# EAGLE design SMINIPROG (EAGLE 9.6.1)
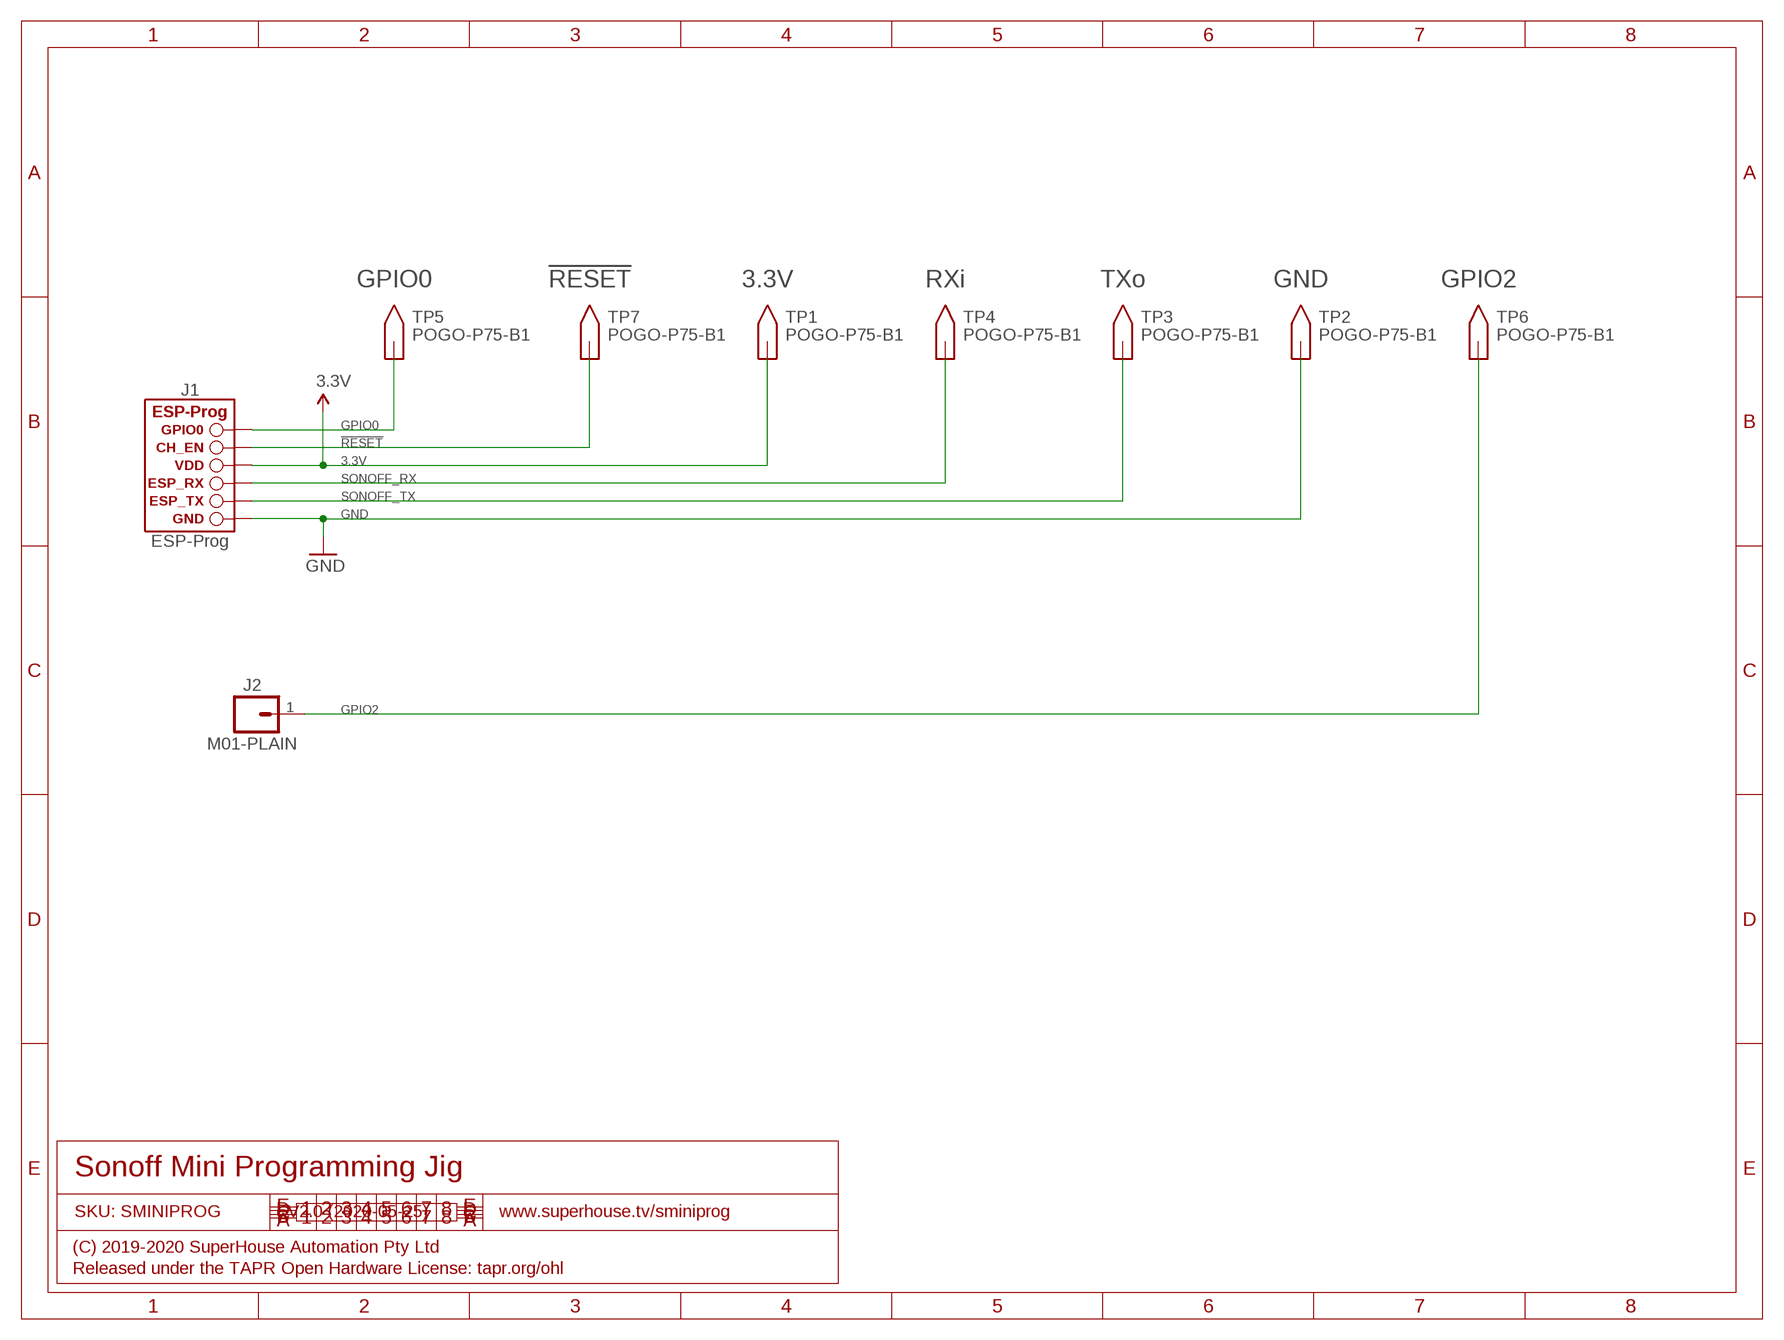
[diagram p0: schematic, sheet 1]

## Parts
J1  ESP-PROG-1X6-2.54-SOCKET-RA  [1X6-2.54-SOCKET-RA]
J2  M01-PLAIN  [1X01]
TP1  POGO-P75-B1  [PIN-1.02]
TP2  POGO-P75-B1  [PIN-1.02]
TP3  POGO-P75-B1  [PIN-1.02]
TP4  POGO-P75-B1  [PIN-1.02]
TP5  POGO-P75-B1  [PIN-1.02]
TP6  POGO-P75-B1  [PIN-1.02]
TP7  POGO-P75-B1  [PIN-1.02]

## Nets
3.3V: J1.4(VDD) TP1.P$1
!RESET: J1.5(CH_EN) TP7.P$1
GND: J1.1(GND) TP2.P$1
GPIO0: J1.6(GPIO0) TP5.P$1
GPIO2: J2.1 TP6.P$1
SONOFF_RX: J1.3(ESP_RX) TP4.P$1
SONOFF_TX: J1.2(ESP_TX) TP3.P$1

## Notes on the sheet
- GPIO0 | !RESET | 3.3V | RXi | TXo | GND | GPIO2
- Sonoff Mini Programming Jig
- SKU: SMINIPROG | V2.0 (2020-05-25) | www.superhouse.tv/sminiprog
- (C) 2019-2020 SuperHouse Automation Pty Ltd
- Released under the TAPR Open Hardware License: tapr.org/ohl

## Library data of the parts
J1 = SuperHouse-ESP-Prog:ESP-PROG: ESP-Prog ESP-Prog programming header for ESP8266, ESP8285, and ESP32. Options for both 1x6 and 2x3 formats, in 2.54mm (0.1") and 1.27mm (0.05") pitch.
J2 = SuperHouse-Connectors:M01: 1-way header Standard 1x1 header
TP1-TP7 = SuperHouse-Test:POGO

## Board
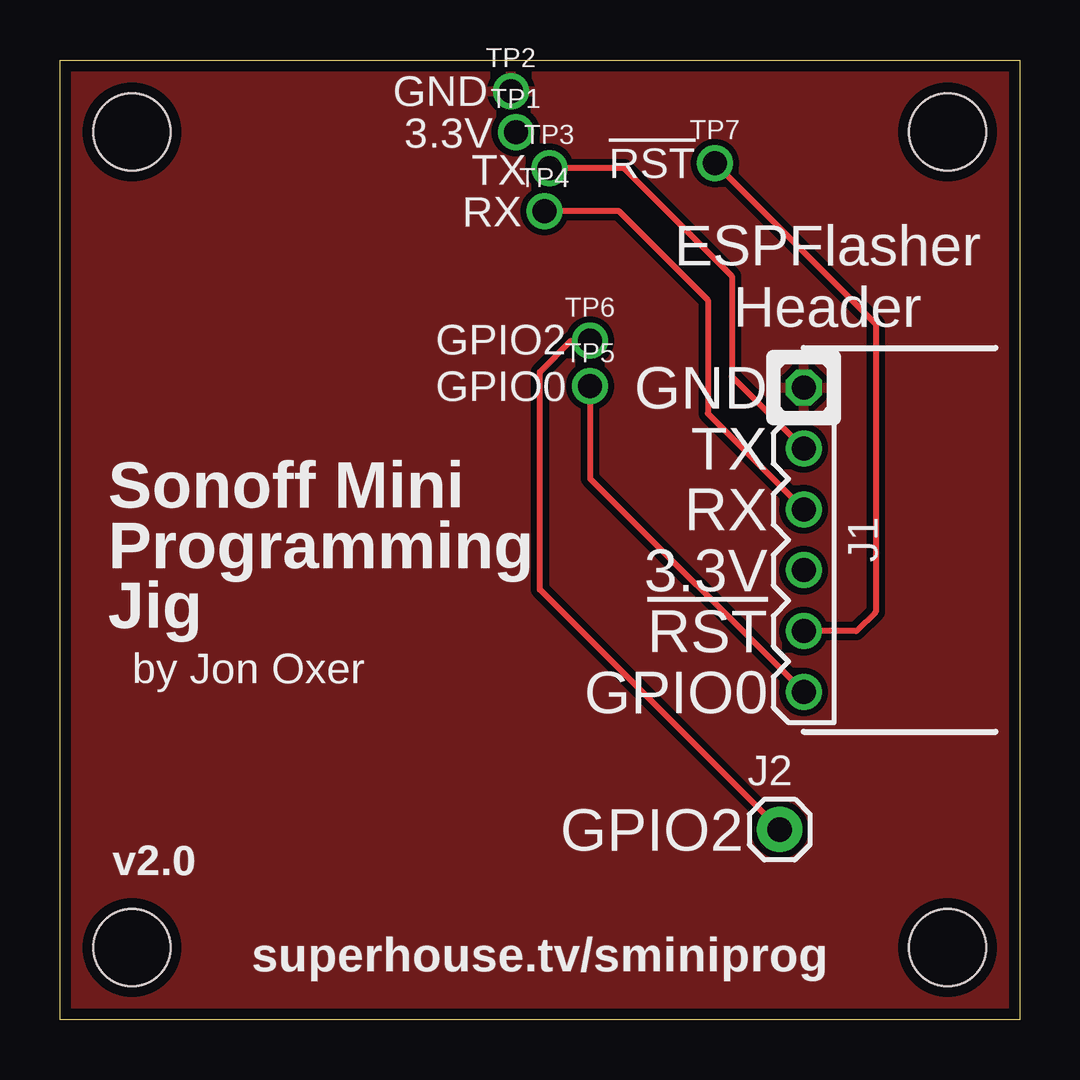
[diagram p1: board, top side]
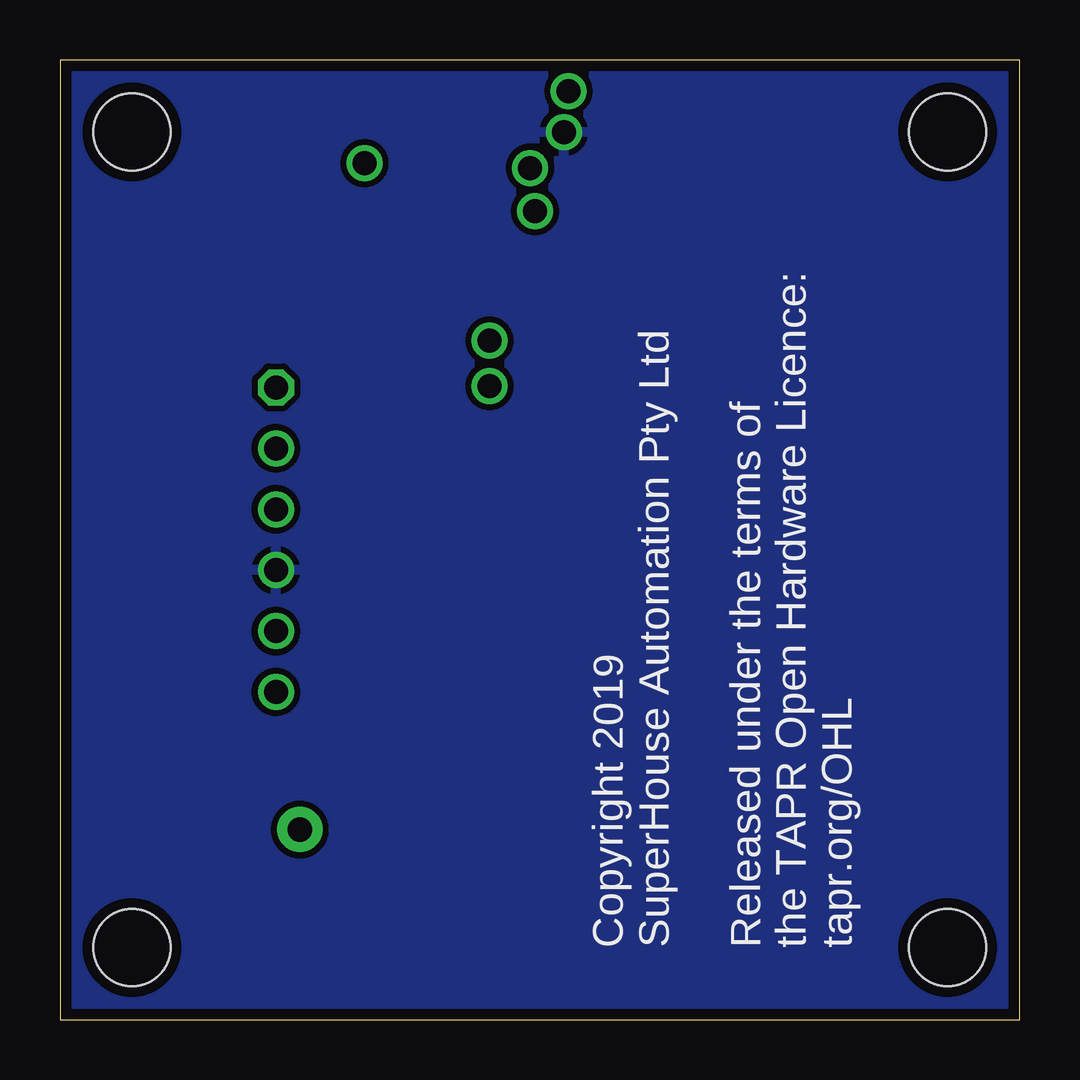
[diagram p2: board, bottom side, seen from below]

Size 40 x 40 mm. Coordinates in mm from the lower left corner, seen from the top.
Outline: 0,40 40,40 40,0 0,0 0,40
Copper layers (1*16): Top 0.035mm / dielectric 1.5mm / Bottom 0.035mm
Design rules "SuperHouse-Design-Rules": minimum track width 10mil, minimum drill 24mil, track to track 8mil, track to pad 8mil, pad to pad 8mil, via to via 8mil, smd to smd 6mil, copper to edge 18mil, drill to drill 8mil, minimum pad ring 7mil, minimum via ring 8mil, stop-mask expansion 4mil, vias tented up to drill 0.5mm, thermal gap 10mil
Holes 3.2 mm at 3,37 3,3 37,3 37,37

### Footprints (pad centres in the part's own frame; a part is rotated, then mirrored left to right if it is on the bottom)
1X6-2.54-SOCKET-RA = drill 1 octagon: 1 -6.35,0 | drill 1: 2 -3.81,0; 3 -1.27,0; 4 1.27,0; 5 3.81,0; 6 6.35,0
1X01 = drill 1.016 pad 1.88: 1 0,0
PIN-1.02 = drill 1: P$1 0,0

### Placement (x,y rotation side)
J1  31,20 270 top
J2  30,7.92 0 top
TP1  19,37 0 top
TP2  18.8,38.7 0 top
TP3  20.4,35.5 0 top
TP4  20.2,33.7 0 top
TP5  22.1,26.4 0 top
TP6  22.1,28.3 0 top
TP7  27.3,35.7 0 top

### Tracks (layer width: path | path; a pad name or v marks a point on that pad's centre or on a via)
3.3V
  pour Bottom (isolate 0.254): 40,40 40,0 0,0 0,40
!RESET
  Top 0.254: J1.5 33.19,16.19 34,17 34,29 TP7.P$1
GND
  pour Top (isolate 0.254): 40,40 40,0 0,0 0,40
GPIO0
  Top 0.254: J1.6 22.1,22.55 TP5.P$1
GPIO2
  Top 0.254: J2.1 20,17.92 20,27 21.3,28.3 TP6.P$1
SONOFF_RX
  Top 0.254: TP4.P$1 23.3,33.7 27,30 27,25.27 J1.3
SONOFF_TX
  Top 0.254: TP3.P$1 23.5,35.5 28,31 28,26.81 J1.2

### Text on the board
tPlace: GND | 3.3V | !RST | TX | RX | ESPFlasher / Header | GPIO2 | GPIO0 | GND | TX | RX | 3.3V | Sonoff Mini / Programming / Jig | !RST | by Jon Oxer | GPIO0 | GPIO2 | v2.0 | superhouse.tv/sminiprog
bPlace: Copyright 2019 / SuperHouse Automation Pty Ltd / / Released under the terms of / the TAPR Open Hardware Licence: / tapr.org/OHL